# EAGLE design base (EAGLE 9.1.3)
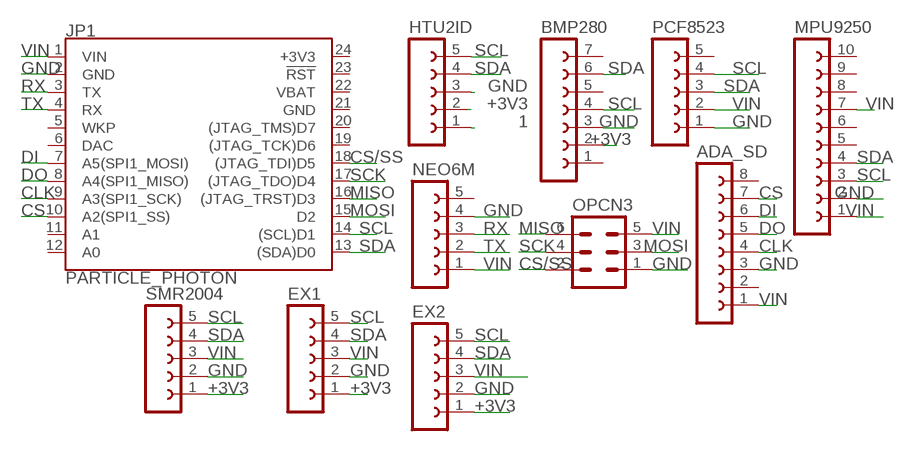
[diagram p0: schematic, sheet 1]

## Parts
ADA_SD  FE08-1  [FE08]
BMP280  FE07-1  [FE07]
EX1  FE05-1  [FE05-1]
EX2  FE05-1  [FE05-1]
HTU2ID  FE05-1  [FE05-1]
JP1  PARTICLE_PHOTON  [PARTICLE_PHOTON]
MPU9250  FE10-1  [FE10]
NEO6M  FE05-1  [FE05-1]
OPCN3  MA03-2  [MA03-2]
PCF8523  FE05-1  [FE05-1]
SMR2004  FE05-1  [FE05-1]

## Nets
1: HTU2ID.1
+3V3: BMP280.2 EX1.1 EX2.1 HTU2ID.2 SMR2004.1
CLK: ADA_SD.4 JP1.9(A3(SPI1_SCK))
CS: ADA_SD.7 JP1.10(A2(SPI1_SS))
CS/SS: JP1.18((JTAG_TDI)D5) OPCN3.2
DI: ADA_SD.6 JP1.7(A5(SPI1_MOSI))
DO: ADA_SD.5 JP1.8(A4(SPI1_MISO))
GND: ADA_SD.3 BMP280.3 EX1.2 EX2.2 HTU2ID.3 JP1.2(GND) MPU9250.2 NEO6M.4 OPCN3.1 PCF8523.1 SMR2004.2
MISO: JP1.16((JTAG_TRST)D3) OPCN3.6
MOSI: JP1.15(D2) OPCN3.3
RX: JP1.3(TX) NEO6M.3
SCK: JP1.17((JTAG_TDO)D4) OPCN3.4
SCL: BMP280.4 EX1.5 EX2.5 HTU2ID.5 JP1.14((SCL)D1) MPU9250.3 PCF8523.4 SMR2004.5
SDA: BMP280.6 EX1.4 EX2.4 HTU2ID.4 JP1.13((SDA)D0) MPU9250.4 PCF8523.3 SMR2004.4
TX: JP1.4(RX) NEO6M.2
VIN: ADA_SD.1 EX1.3 EX2.3 JP1.1(VIN) MPU9250.1 MPU9250.7 NEO6M.1 OPCN3.5 PCF8523.2 SMR2004.3
Unconnected: ADA_SD.2 ADA_SD.8 BMP280.1 BMP280.5 BMP280.7 JP1.5(WKP) JP1.6(DAC) JP1.11(A1) JP1.12(A0) JP1.19((JTAG_TCK)D6) JP1.20((JTAG_TMS)D7) JP1.23(!RST!) MPU9250.5 MPU9250.6 MPU9250.8 MPU9250.9 MPU9250.10 NEO6M.5 PCF8523.5

## Power pins joined to a net without a drawn wire
+3V3: JP1.24(+3V3)
GND: JP1.21(GND)
VBAT: JP1.22(VBAT)

## Library data of the parts
ADA_SD = con-lsta:FE08-1: FEMALE HEADER; OC_FARNELL: unknown; OC_NEWARK: unknown
BMP280 = con-lsta:FE07-1: FEMALE HEADER; OC_FARNELL: unknown; OC_NEWARK: unknown
EX1 EX2 HTU2ID NEO6M PCF8523 SMR2004 = con-lsta:FE05-1: FEMALE HEADER; OC_FARNELL: unknown; OC_NEWARK: unknown
JP1 = SparkFun-Boards:PARTICLE_PHOTON: Particle Photon Footprint of the Particle Photon that is used as a basis for many Photon shields. SparkFun Products: Particle Photon <https://www.sparkfun.com/products/13764> SparkFun Photon ProtoShield <https://www.sparkfun.com/products/13598> SparkFun Photon micro OLED Shield <https://www.sparkfun.com/products/13628> SparkFun Photon IMU Shield <https://www.sparkfun.com/products/13629> SparkFun Photon Battery Shield <https://www.sparkfun.com/products/13626>
MPU9250 = con-lsta:FE10-1: FEMALE HEADER; OC_FARNELL: unknown; OC_NEWARK: unknown
OPCN3 = con-lstb:MA03-2: PIN HEADER; OC_FARNELL: unknown; OC_NEWARK: unknown

## Board
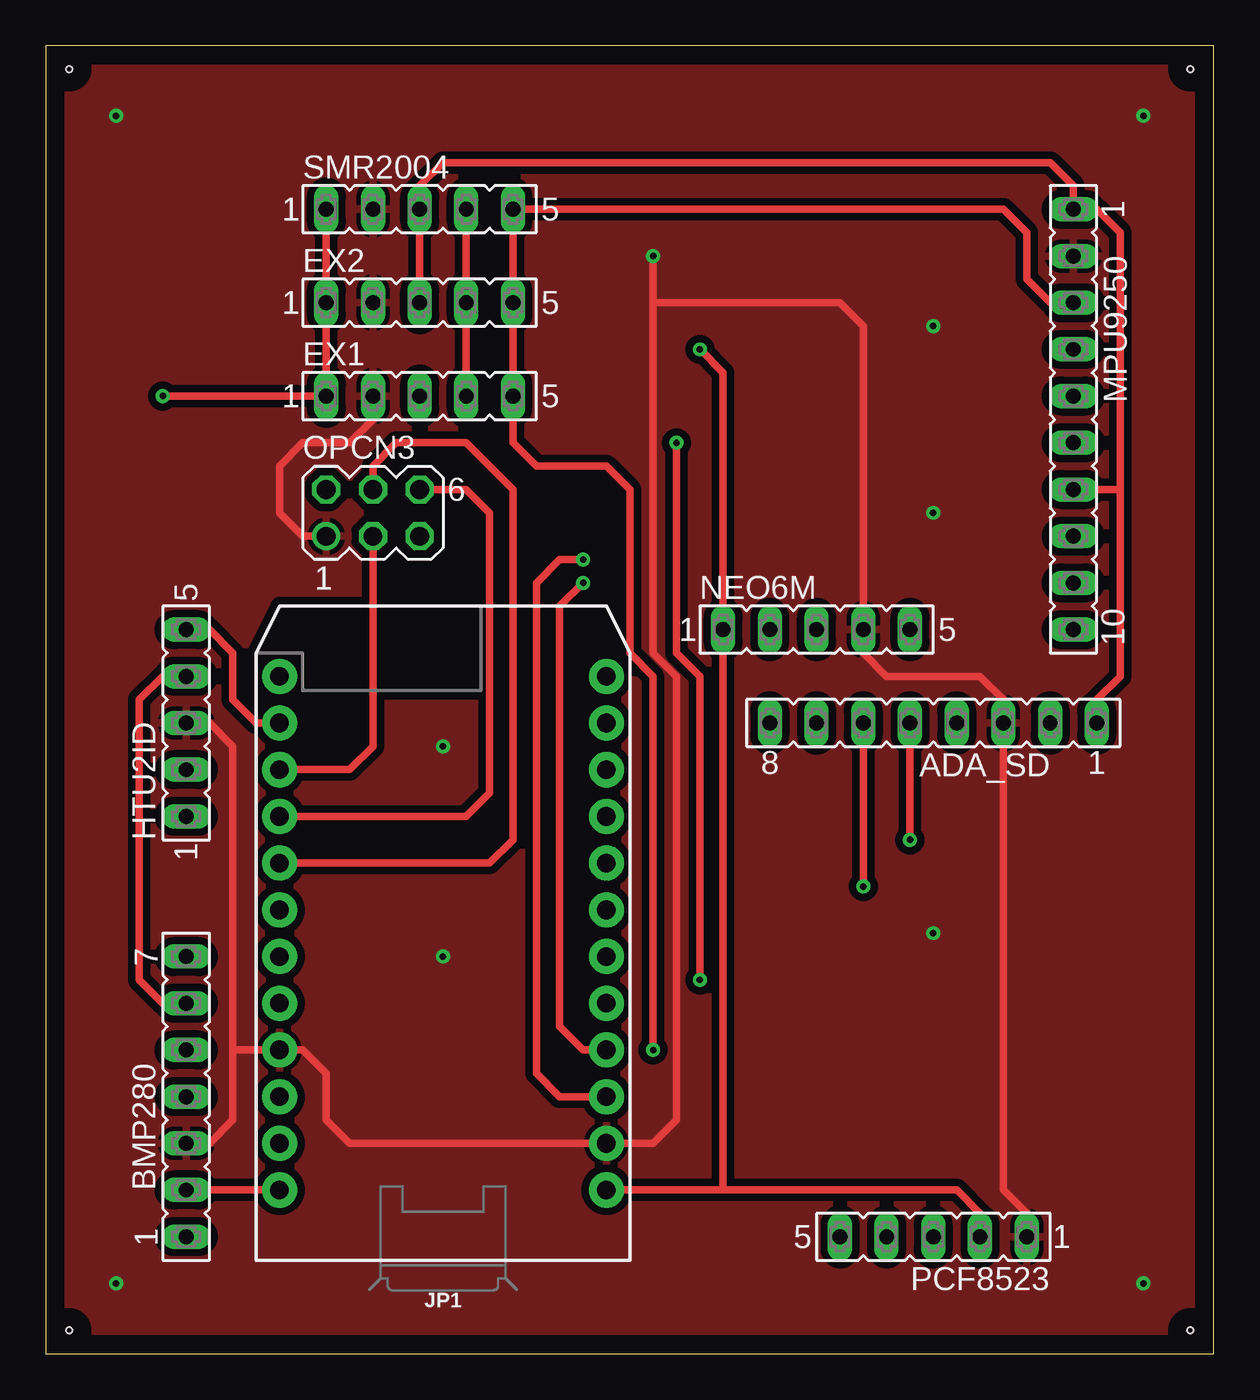
[diagram p1: board, top side]
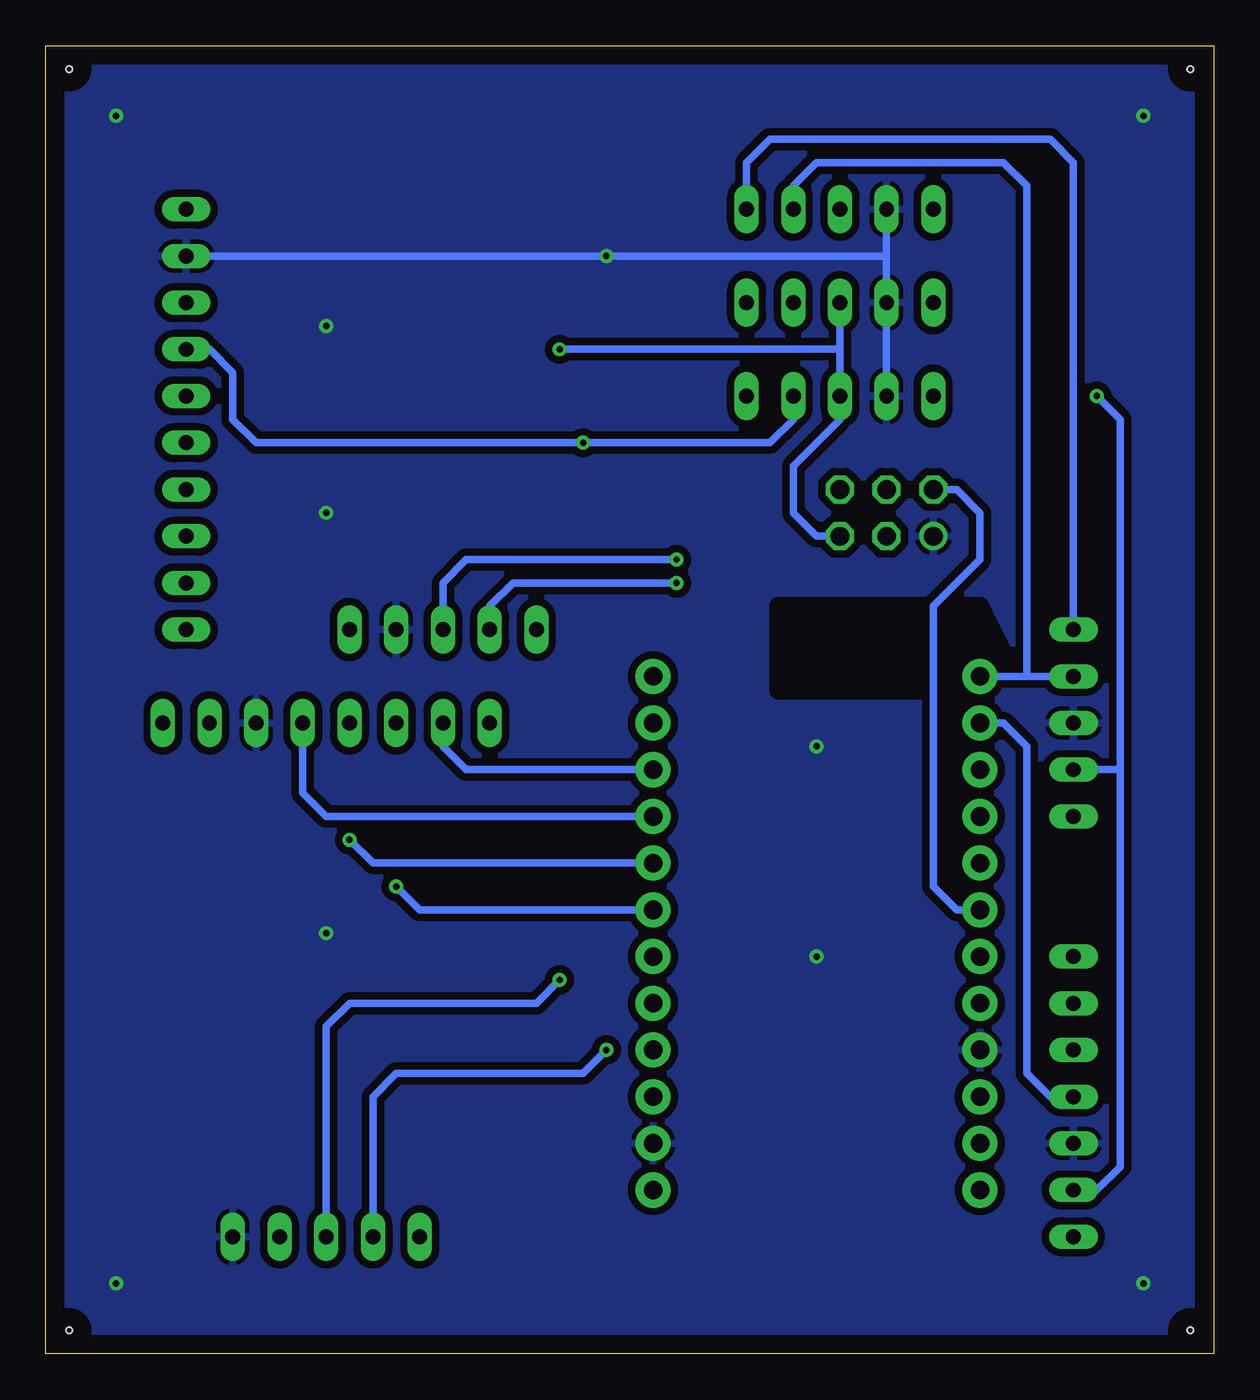
[diagram p2: board, bottom side, seen from below]

Size 63.5 x 71.11 mm. Coordinates in mm from the lower left corner, seen from the top.
Outline: 0,0 63.5,0 63.5,71.11 0,71.11 0,0
Copper layers (1*16): Top 0.035mm / dielectric 1.5mm / Bottom 0.035mm
Design rules "default": minimum track width 6mil, minimum drill 0.35mm, track to track 6mil, track to pad 6mil, pad to pad 6mil, via to via 6mil, smd to smd 6mil, copper to edge 40mil, drill to drill 6mil, minimum pad ring 10mil, minimum via ring 8mil, stop-mask expansion 4mil, vias tented up to drill 0mil, thermal gap 10mil
Holes 0.35 mm at 1.27,1.27 1.27,69.85 62.23,69.85 62.23,1.27

### Footprints (pad centres in the part's own frame; a part is rotated, then mirrored left to right if it is on the bottom)
FE08 = drill 0.813 long: 1 -8.89,0; 2 -6.35,0; 3 -3.81,0; 4 -1.27,0; 5 1.27,0; 6 3.81,0; 7 6.35,0; 8 8.89,0
FE07 = drill 0.813 long: 1 -7.62,0; 2 -5.08,0; 3 -2.54,0; 4 0,0; 5 2.54,0; 6 5.08,0; 7 7.62,0
FE05-1 = drill 0.813 long: 1 -5.08,0; 2 -2.54,0; 3 0,0; 4 2.54,0; 5 5.08,0
PARTICLE_PHOTON = drill 1.016 pad 1.905: 1 -8.89,13.97; 2 -8.89,11.43; 3 -8.89,8.89; 4 -8.89,6.35; 5 -8.89,3.81; 6 -8.89,1.27; 7 -8.89,-1.27; 8 -8.89,-3.81; 9 -8.89,-6.35; 10 -8.89,-8.89; 11 -8.89,-11.43; 12 -8.89,-13.97; 13 8.89,-13.97; 14 8.89,-11.43; 15 8.89,-8.89; 16 8.89,-6.35; 17 8.89,-3.81; 18 8.89,-1.27; 19 8.89,1.27; 20 8.89,3.81; 21 8.89,6.35; 22 8.89,8.89; 23 8.89,11.43; 24 8.89,13.97
FE10 = drill 0.813 long: 1 -11.43,0; 2 -8.89,0; 3 -6.35,0; 4 -3.81,0; 5 -1.27,0; 6 1.27,0; 7 3.81,0; 8 6.35,0; 9 8.89,0; 10 11.43,0
MA03-2 = drill 1.016: 1 -2.54,-1.27 | drill 1.016 octagon: 2 -2.54,1.27; 3 0,-1.27; 4 0,1.27; 5 2.54,-1.27; 6 2.54,1.27

### Placement (x,y rotation side)
ADA_SD  48.26,34.29 180 top
BMP280  7.62,13.97 90 top
EX1  20.32,52.07 0 top
EX2  20.32,57.15 0 top
HTU2ID  7.62,34.29 90 top
JP1  21.59,22.86 180 top
MPU9250  55.88,50.8 270 top
NEO6M  41.91,39.37 0 top
OPCN3  17.78,45.72 0 top
PCF8523  48.26,6.35 180 top
SMR2004  20.32,62.23 0 top

### Tracks (layer width: path | path; a pad name or v marks a point on that pad's centre or on a via)
+3V3  (via drill 0.35)
  Top 0.406: BMP280.2 JP1.24 | SMR2004.1 EX2.1 EX1.1 v6.35,52.07
  Bottom 0.254: HTU2ID.2 6.35,31.75
  Bottom 0.406: v6.35,52.07 5.08,50.8 5.08,33.02 5.08,31.75 | HTU2ID.2 5.08,31.75 | BMP280.2 6.35,8.89 5.08,10.16 5.08,31.75
CLK
  Bottom 0.406: JP1.9 48.26,29.21 49.53,30.48 ADA_SD.4
CS
  Bottom 0.406: JP1.10 40.64,31.75 41.91,33.02 ADA_SD.7
CS/SS
  Bottom 0.406: OPCN3.2 13.97,46.99 12.7,45.72 12.7,43.18 15.24,40.64 | 15.24,40.64 15.24,25.4 13.97,24.13 JP1.18 | 15.24,40.64
DI  (via drill 0.35)
  Top 0.406: v44.45,25.4 ADA_SD.6
  Bottom 0.406: JP1.7 43.18,24.13 v44.45,25.4
DO  (via drill 0.35)
  Top 0.406: v46.99,27.94 ADA_SD.5
  Bottom 0.406: JP1.8 45.72,26.67 v46.99,27.94
GND  (via drill 0.35)
  Top 0.254: JP1.21 11.43,16.51 | 10.16,15.24 10.16,13.97
  Top 0.406: PCF8523.1 53.34,7.62 52.07,8.89 ADA_SD.3 52.07,35.56 50.8,36.83 45.72,36.83 44.45,38.1 NEO6M.4 44.45,55.88 43.18,57.15 33.02,57.15 | 10.16,16.51 JP1.21 13.97,16.51 15.24,15.24 15.24,12.7 16.51,11.43 JP1.2 33.02,11.43 34.29,12.7 34.29,36.83 33.02,38.1 33.02,57.15 | BMP280.3 8.89,11.43 10.16,12.7 10.16,13.97 10.16,16.51 | 10.16,16.51 10.16,33.02 8.89,34.29 HTU2ID.3 | EX1.2 17.78,50.8 16.51,49.53 13.97,49.53 12.7,48.26 12.7,45.72 13.97,44.45 OPCN3.1 | 33.02,57.15 v33.02,59.69
  Bottom 0.406: 17.78,59.69 SMR2004.2 | 17.78,59.69 v33.02,59.69 MPU9250.2 | 17.78,59.69 EX2.2 EX1.2
  other vias: 3.81,67.31 59.69,67.31 48.26,55.88 48.26,45.72 21.59,33.02 21.59,21.59 48.26,22.86 3.81,3.81 59.69,3.81
  pour Bottom (isolate 0.406): 0,71.12 0,0 63.5,0 63.5,71.12
  pour Top (isolate 0.406): -1.27,72.39 -1.27,-1.27 64.77,-1.27 64.77,72.39
MISO
  Top 0.406: OPCN3.6 22.86,46.99 24.13,45.72 24.13,30.48 22.86,29.21 JP1.16
MOSI
  Top 0.406: OPCN3.3 17.78,33.02 16.51,31.75 JP1.15
RX  (via drill 0.35)
  Top 0.406: JP1.3 27.94,13.97 26.67,15.24 26.67,41.91 27.94,43.18 v29.21,43.18
  Bottom 0.406: v29.21,43.18 40.64,43.18 41.91,41.91 NEO6M.3
SCK
  Top 0.406: JP1.17 24.13,26.67 25.4,27.94 25.4,46.99 22.86,49.53 19.05,49.53 17.78,48.26 OPCN3.4
SCL  (via drill 0.35)
  Top 0.406: JP1.14 11.43,34.29 10.16,35.56 10.16,38.1 8.89,39.37 HTU2ID.5 | v33.02,16.51 33.02,36.83 31.75,38.1 31.75,46.99 30.48,48.26 26.67,48.26 25.4,49.53 EX1.5 EX2.5 SMR2004.5 52.07,62.23 53.34,60.96 53.34,58.42 54.61,57.15 MPU9250.3
  Bottom 0.406: PCF8523.4 45.72,13.97 44.45,15.24 34.29,15.24 v33.02,16.51 | SMR2004.5 25.4,63.5 25.4,64.77 24.13,66.04 8.89,66.04 7.62,64.77 HTU2ID.5 | JP1.14 11.43,34.29 10.16,33.02 10.16,15.24 8.89,13.97 BMP280.4
SDA  (via drill 0.35)
  Top 0.406: EX1.4 EX2.4 SMR2004.4 | BMP280.6 6.35,19.05 5.08,20.32 5.08,35.56 6.35,36.83 HTU2ID.4 | v34.29,49.53 34.29,38.1 35.56,36.83 v35.56,20.32
  Bottom 0.406: EX1.4 22.86,50.8 24.13,49.53 v34.29,49.53 52.07,49.53 53.34,50.8 53.34,53.34 54.61,54.61 MPU9250.4 | PCF8523.3 48.26,17.78 46.99,19.05 36.83,19.05 v35.56,20.32 | HTU2ID.4 8.89,36.83 10.16,36.83 | JP1.13 10.16,36.83 | 10.16,36.83 10.16,63.5 11.43,64.77 21.59,64.77 22.86,63.5 SMR2004.4
TX  (via drill 0.35)
  Top 0.406: JP1.4 29.21,16.51 27.94,17.78 27.94,40.64 v29.21,41.91
  Bottom 0.406: v29.21,41.91 38.1,41.91 39.37,40.64 NEO6M.2
VIN  (via drill 0.35)
  Top 0.254: MPU9250.7 57.15,46.99
  Top 0.406: 36.83,8.89 36.83,19.05 NEO6M.1 36.83,53.34 v35.56,54.61 | EX2.3 SMR2004.3 20.32,63.5 21.59,64.77 54.61,64.77 55.88,63.5 MPU9250.1 57.15,62.23 58.42,60.96 58.42,46.99 | 58.42,46.99 58.42,36.83 57.15,35.56 ADA_SD.1 | 36.83,8.89 35.56,8.89 JP1.1 | 58.42,46.99 MPU9250.7 | PCF8523.2 50.8,7.62 49.53,8.89 36.83,8.89
  Bottom 0.406: v35.56,54.61 20.32,54.61 | 20.32,54.61 EX2.3 | 20.32,54.61 EX1.3 20.32,50.8 22.86,48.26 22.86,45.72 21.59,44.45 OPCN3.5